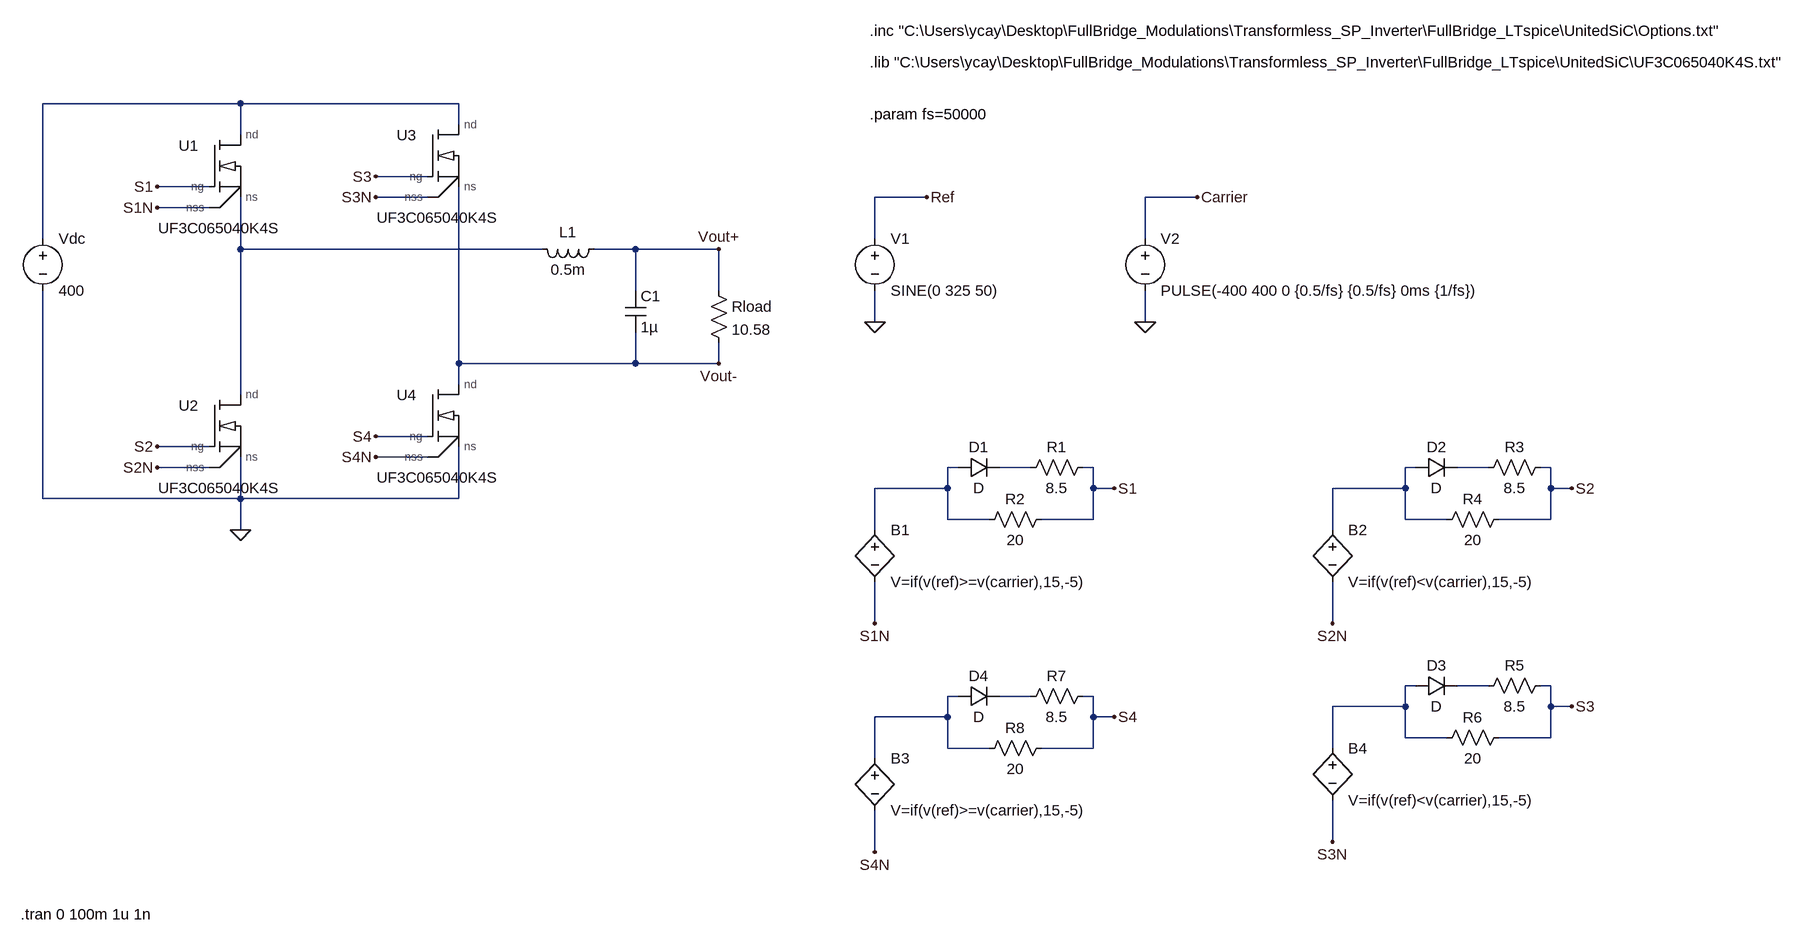
[diagram p0: schematic Bipolar_UF3C065040K4S.asc]
Bipolar_UF3C065040K4S.asc, the LTspice schematic file:
Version 4
SHEET 1 3364 1072
WIRE -496 -192 -800 -192
WIRE -160 -192 -496 -192
WIRE -160 -160 -160 -192
WIRE -496 -144 -496 -192
WIRE -208 -80 -288 -80
WIRE -544 -64 -624 -64
WIRE -208 -48 -288 -48
WIRE 560 -48 480 -48
WIRE 976 -48 896 -48
WIRE -544 -32 -624 -32
WIRE -800 16 -800 -192
WIRE 480 16 480 -48
WIRE 896 16 896 -48
WIRE -496 32 -496 -48
WIRE -32 32 -496 32
WIRE 112 32 48 32
WIRE 240 32 112 32
WIRE 112 96 112 32
WIRE 240 96 240 32
WIRE 480 144 480 96
WIRE 896 144 896 96
WIRE -160 208 -160 -64
WIRE 112 208 112 160
WIRE 112 208 -160 208
WIRE 240 208 240 176
WIRE 240 208 112 208
WIRE -160 240 -160 208
WIRE -496 256 -496 32
WIRE -208 320 -288 320
WIRE -544 336 -624 336
WIRE -208 352 -288 352
WIRE -544 368 -624 368
WIRE 608 368 592 368
WIRE 720 368 672 368
WIRE 816 368 800 368
WIRE 1312 368 1296 368
WIRE 1424 368 1376 368
WIRE 1520 368 1504 368
WIRE 592 400 592 368
WIRE 592 400 480 400
WIRE 816 400 816 368
WIRE 848 400 816 400
WIRE 1296 400 1296 368
WIRE 1296 400 1184 400
WIRE 1520 400 1520 368
WIRE 1552 400 1520 400
WIRE -800 416 -800 96
WIRE -496 416 -496 352
WIRE -496 416 -800 416
WIRE -160 416 -160 336
WIRE -160 416 -496 416
WIRE 592 448 592 400
WIRE 656 448 592 448
WIRE 816 448 816 400
WIRE 816 448 736 448
WIRE 1296 448 1296 400
WIRE 1360 448 1296 448
WIRE 1520 448 1520 400
WIRE 1520 448 1440 448
WIRE -496 464 -496 416
WIRE 480 464 480 400
WIRE 1184 464 1184 400
WIRE 480 608 480 544
WIRE 1184 608 1184 544
WIRE 1312 704 1296 704
WIRE 1424 704 1376 704
WIRE 1520 704 1504 704
WIRE 608 720 592 720
WIRE 720 720 672 720
WIRE 816 720 800 720
WIRE 1296 736 1296 704
WIRE 1296 736 1184 736
WIRE 1520 736 1520 704
WIRE 1552 736 1520 736
WIRE 592 752 592 720
WIRE 592 752 480 752
WIRE 816 752 816 720
WIRE 848 752 816 752
WIRE 1296 784 1296 736
WIRE 1360 784 1296 784
WIRE 1520 784 1520 736
WIRE 1520 784 1440 784
WIRE 592 800 592 752
WIRE 656 800 592 800
WIRE 816 800 816 752
WIRE 816 800 736 800
WIRE 1184 800 1184 736
WIRE 480 816 480 752
WIRE 1184 944 1184 880
WIRE 480 960 480 896
FLAG 480 144 0
FLAG 560 -48 Ref
FLAG 896 144 0
FLAG 976 -48 Carrier
FLAG 848 400 S1
FLAG 1552 400 S2
FLAG -496 464 0
FLAG 240 32 Vout+
FLAG 240 208 Vout-
FLAG 480 608 S1N
FLAG 1184 608 S2N
FLAG 848 752 S4
FLAG 480 960 S4N
FLAG 1552 736 S3
FLAG 1184 944 S3N
FLAG -624 -64 S1
FLAG -624 -32 S1N
FLAG -288 320 S4
FLAG -288 352 S4N
FLAG -624 336 S2
FLAG -624 368 S2N
FLAG -288 -80 S3
FLAG -288 -48 S3N
SYMBOL voltage 480 0 R0
WINDOW 123 0 0 Left 0
WINDOW 39 0 0 Left 0
SYMATTR InstName V1
SYMATTR Value SINE(0 325 50)
SYMBOL voltage 896 0 R0
WINDOW 123 0 0 Left 0
WINDOW 39 0 0 Left 0
SYMATTR InstName V2
SYMATTR Value PULSE(-400 400 0 {0.5/fs} {0.5/fs} 0ms {1/fs})
SYMBOL bv 480 448 R0
SYMATTR InstName B1
SYMATTR Value V=if(v(ref)>=v(carrier),15,-5)
SYMBOL bv 1184 448 R0
SYMATTR InstName B2
SYMATTR Value V=if(v(ref)<v(carrier),15,-5)
SYMBOL ind 64 16 R90
WINDOW 0 5 56 VBottom 2
WINDOW 3 32 56 VTop 2
SYMATTR InstName L1
SYMATTR Value 0.5m
SYMATTR SpiceLine Rser=30m
SYMBOL res 224 80 R0
SYMATTR InstName Rload
SYMATTR Value 10.58
SYMBOL voltage -800 0 R0
WINDOW 123 0 0 Left 0
WINDOW 39 0 0 Left 0
SYMATTR InstName Vdc
SYMATTR Value 400
SYMBOL cap 96 96 R0
SYMATTR InstName C1
SYMATTR Value 1µ
SYMATTR SpiceLine Rser=0.11m
SYMBOL AutoGenerated\\UF3C065040K4S -528 -96 R0
SYMATTR InstName U1
SYMBOL AutoGenerated\\UF3C065040K4S -528 304 R0
SYMATTR InstName U2
SYMBOL AutoGenerated\\UF3C065040K4S -192 -112 R0
SYMATTR InstName U3
SYMBOL AutoGenerated\\UF3C065040K4S -192 288 R0
SYMATTR InstName U4
SYMBOL res 816 352 R90
WINDOW 0 0 56 VBottom 2
WINDOW 3 32 56 VTop 2
SYMATTR InstName R1
SYMATTR Value 8.5
SYMBOL diode 608 384 R270
WINDOW 0 32 32 VTop 2
WINDOW 3 0 32 VBottom 2
SYMATTR InstName D1
SYMBOL res 752 432 R90
WINDOW 0 0 56 VBottom 2
WINDOW 3 32 56 VTop 2
SYMATTR InstName R2
SYMATTR Value 20
SYMBOL bv 480 800 R0
SYMATTR InstName B3
SYMATTR Value V=if(v(ref)>=v(carrier),15,-5)
SYMBOL bv 1184 784 R0
SYMATTR InstName B4
SYMATTR Value V=if(v(ref)<v(carrier),15,-5)
SYMBOL res 1520 352 R90
WINDOW 0 0 56 VBottom 2
WINDOW 3 32 56 VTop 2
SYMATTR InstName R3
SYMATTR Value 8.5
SYMBOL diode 1312 384 R270
WINDOW 0 32 32 VTop 2
WINDOW 3 0 32 VBottom 2
SYMATTR InstName D2
SYMBOL res 1456 432 R90
WINDOW 0 0 56 VBottom 2
WINDOW 3 32 56 VTop 2
SYMATTR InstName R4
SYMATTR Value 20
SYMBOL res 1520 688 R90
WINDOW 0 0 56 VBottom 2
WINDOW 3 32 56 VTop 2
SYMATTR InstName R5
SYMATTR Value 8.5
SYMBOL diode 1312 720 R270
WINDOW 0 32 32 VTop 2
WINDOW 3 0 32 VBottom 2
SYMATTR InstName D3
SYMBOL res 1456 768 R90
WINDOW 0 0 56 VBottom 2
WINDOW 3 32 56 VTop 2
SYMATTR InstName R6
SYMATTR Value 20
SYMBOL res 816 704 R90
WINDOW 0 0 56 VBottom 2
WINDOW 3 32 56 VTop 2
SYMATTR InstName R7
SYMATTR Value 8.5
SYMBOL diode 608 736 R270
WINDOW 0 32 32 VTop 2
WINDOW 3 0 32 VBottom 2
SYMATTR InstName D4
SYMBOL res 752 784 R90
WINDOW 0 0 56 VBottom 2
WINDOW 3 32 56 VTop 2
SYMATTR InstName R8
SYMATTR Value 20
TEXT 472 -176 Left 2 !.param fs=50000
TEXT 472 -256 Left 2 !.lib "C:\\Users\\ycay\\Desktop\\FullBridge_Modulations\\Transformless_SP_Inverter\\FullBridge_LTspice\\UnitedSiC\\UF3C065040K4S.txt"
TEXT 472 -304 Left 2 !.inc "C:\\Users\\ycay\\Desktop\\FullBridge_Modulations\\Transformless_SP_Inverter\\FullBridge_LTspice\\UnitedSiC\\Options.txt"
TEXT -834 1056 Left 2 !.tran 0 100m 1u 1n

The netlist it stands for:
* Bipolar_UF3C065040K4S.asc
V1 Ref 0 SINE(0 325 50)
V2 Carrier 0 PULSE(-400 400 0 {0.5/fs} {0.5/fs} 0ms {1/fs})
B1 N003 S1N V=if(v(ref)>=v(carrier),15,-5)
B2 N005 S2N V=if(v(ref)<v(carrier),15,-5)
L1 Vout+ N002 0.5m Rser=30m
Rload Vout+ Vout- 10.58
Vdc N001 0 400
C1 Vout+ Vout- 1µ Rser=0.11m
XU1 N001 S1 N002 S1N UF3C065040K4S  ; pins nd ng ns nss
XU2 N002 S2 0 S2N UF3C065040K4S  ; pins nd ng ns nss
XU3 N001 S3 Vout- S3N UF3C065040K4S  ; pins nd ng ns nss
XU4 Vout- S4 0 S4N UF3C065040K4S  ; pins nd ng ns nss
R1 S1 N004 8.5
D1 N003 N004 D
R2 S1 N003 20
B3 N009 S4N V=if(v(ref)>=v(carrier),15,-5)
B4 N007 S3N V=if(v(ref)<v(carrier),15,-5)
R3 S2 N006 8.5
D2 N005 N006 D
R4 S2 N005 20
R5 S3 N008 8.5
D3 N007 N008 D
R6 S3 N007 20
R7 S4 N010 8.5
D4 N009 N010 D
R8 S4 N009 20
.model D D
.lib standard.dio
.param fs=50000
.lib "C:\Users\ycay\Desktop\FullBridge_Modulations\Transformless_SP_Inverter\FullBridge_LTspice\UnitedSiC\UF3C065040K4S.txt"
.inc "C:\Users\ycay\Desktop\FullBridge_Modulations\Transformless_SP_Inverter\FullBridge_LTspice\UnitedSiC\Options.txt"
.tran 0 100m 1u 1n
.lib C:\Users\ycay\Desktop\FullBridge_Modulations\Transformless_SP_Inverter\FullBridge_LTspice\UF3C065040K4S\UF3C065040K4S.txt
.backanno
.end